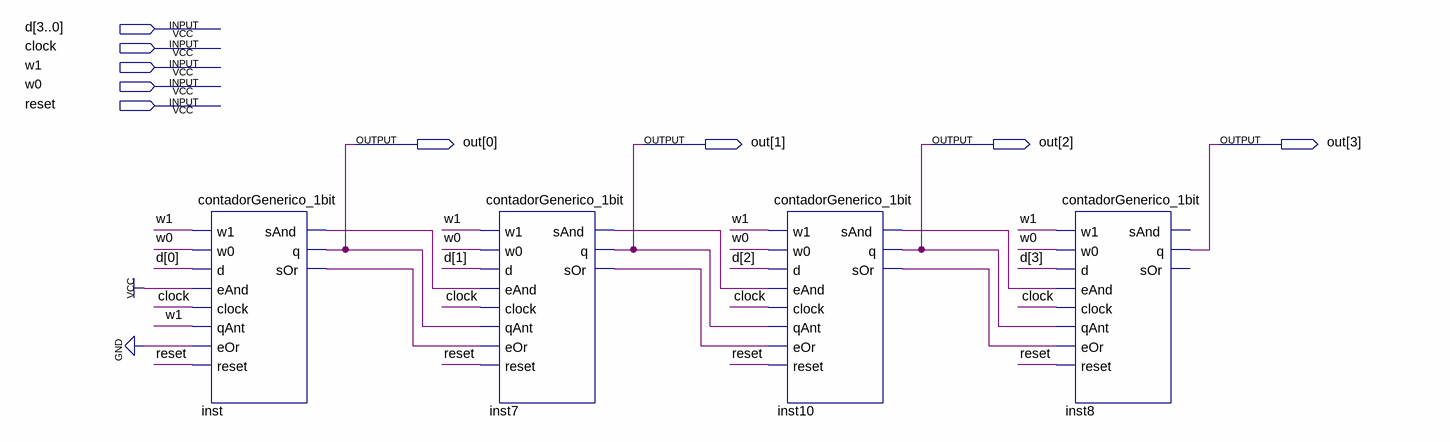
[diagram p0: schematic sheet]
// Quartus schematic testeCont4bit.bdf as structural Verilog: 4 symbols, 9 pins
module testeCont4bit (
  input  [3:0] d,
  input  clock,
  input  w1,
  input  w0,
  input  reset,
  output [3:0] out
);

  wire inst7_sand, inst7_sor, inst10_sand, inst10_sor, inst_sand, inst_sor;

  contadorGenerico_1bit inst (
    .w1(w1), .w0(w0), .d(d[0]), .eAnd(1'b1), .clock(clock), .qAnt(w1), .eOr(1'b0), .reset(reset),
    .sAnd(inst_sand), .q(out[0]), .sOr(inst_sor));
  contadorGenerico_1bit inst7 (
    .w1(w1), .w0(w0), .d(d[1]), .eAnd(inst_sand), .clock(clock), .qAnt(out[0]), .eOr(inst_sor),
    .reset(reset), .sAnd(inst7_sand), .q(out[1]), .sOr(inst7_sor));
  contadorGenerico_1bit inst10 (
    .w1(w1), .w0(w0), .d(d[2]), .eAnd(inst7_sand), .clock(clock), .qAnt(out[1]), .eOr(inst7_sor),
    .reset(reset), .sAnd(inst10_sand), .q(out[2]), .sOr(inst10_sor));
  contadorGenerico_1bit inst8 (
    .w1(w1), .w0(w0), .d(d[3]), .eAnd(inst10_sand), .clock(clock), .qAnt(out[2]), .eOr(inst10_sor),
    .reset(reset), .q(out[3]));  // open: sAnd, sOr
endmodule
